# Altium schematic sheet Sensors.SchDoc
size A; SheetNumber: 4; SheetTotal: 6
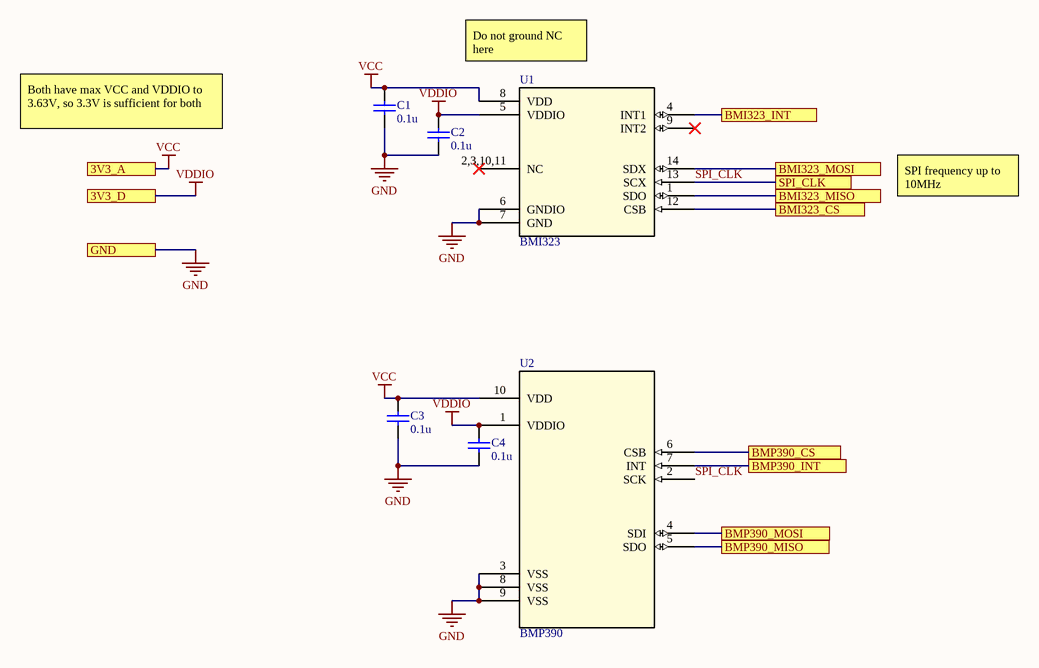
[diagram p0: Sensors.SchDoc]

## Parts
C1  value 0.1u  (hidden comment: Capacitor)
C2  value 0.1u  (hidden comment: Capacitor)
C3  value 0.1u  (hidden comment: Capacitor)
C4  value 0.1u  (hidden comment: Capacitor)
U1  BMI323  [BMI323_BOS]
U2  BMP390  [10LGA_2X2X0p75_BOS]

## Ports
3V3_A, 3V3_D, BMI323_CS, BMI323_INT, BMI323_MISO, BMI323_MOSI, BMP390_CS, BMP390_INT, BMP390_MISO, BMP390_MOSI, GND, SPI_CLK

## Nets
GND: C1.1 C2.1 C3.1 C4.1 U1.6(GNDIO) U1.7(GND) U2.3(VSS) U2.8(VSS) U2.9(VSS) ; port GND
VCC: C1.2 C3.2 U1.8(VDD) U2.10(VDD) ; port 3V3_A
VDDIO: C2.2 C4.2 U1.5(VDDIO) U2.1(VDDIO) ; port 3V3_D
BMI323_CS: U1.12(CSB) ; port BMI323_CS
BMI323_INT: U1.4(INT1) ; port BMI323_INT
BMI323_MISO: U1.1(SDO) ; port BMI323_MISO
BMI323_MOSI: U1.14(SDX) ; port BMI323_MOSI
BMP390_CS: U2.6(CSB) ; port BMP390_CS
BMP390_INT: U2.7(INT) ; port BMP390_INT
BMP390_MISO: U2.5(SDO) ; port BMP390_MISO
BMP390_MOSI: U2.4(SDI) ; port BMP390_MOSI
SPI_CLK: U1.13(SCX) U2.2(SCK) ; port SPI_CLK

Not connected (* = marked no-connect by the designer): U1 2,3,10,11(NC)* 9(INT2)*

## Notes on the sheet
- (near U1) Do not ground NC here
- Both have max VCC and VDDIO to 3.63V, so 3.3V is sufficient for both
- SPI frequency up to 10MHz

## Library data of the parts
C1-C4 = Capacitor: SimulationGenericComponent: True
U1 = BMI323: Description; Manufacturer_Name: Bosch Sensortec; Copyright: Copyright (C) 2025 Ultra Librarian. All rights reserved.; Manufacturer_Part_Number: BMI323; RefDes: RefDes; Type: Type
U2 = BMP390: Description; Manufacturer_Name: Bosch Sensortec; Copyright: Copyright (C) 2025 Ultra Librarian. All rights reserved.; Manufacturer_Part_Number: BMP390; RefDes: RefDes; Type: Type